# Altium schematic sheet task5.SchDoc
size A
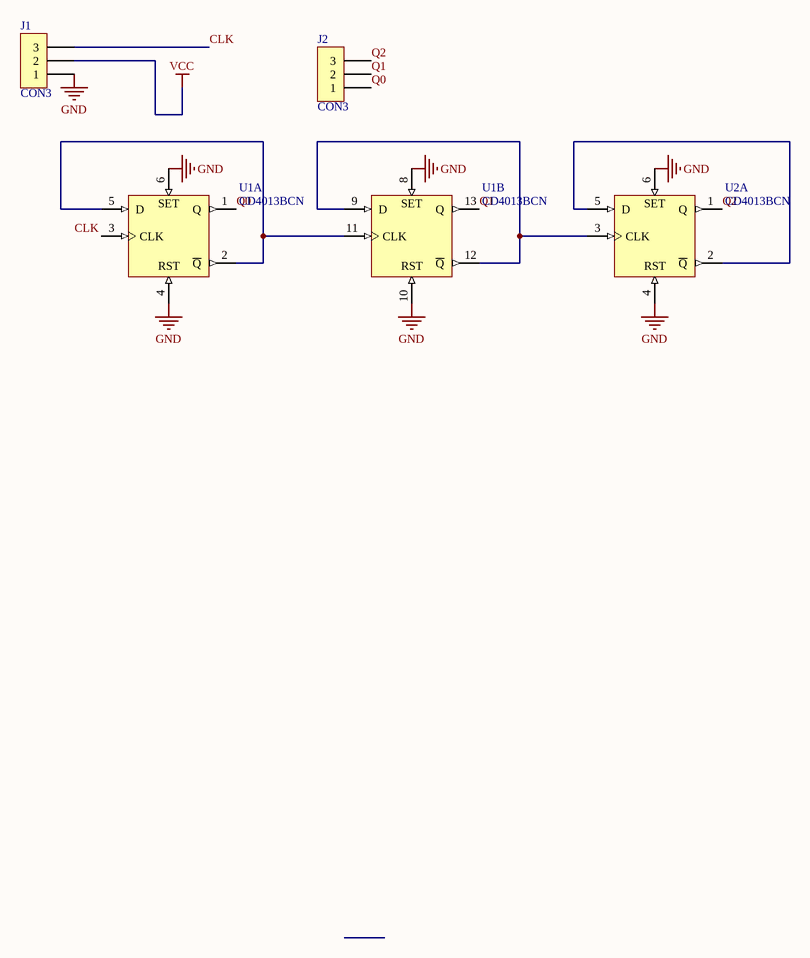
[diagram p0: task5.SchDoc]

## Parts
J1  CON3  [SIP3]
J2  CON3  [SIP3]
U1  CD4013BCN  [N14A]  (parts A,B of 2)
U2  CD4013BCN  [N14A]  (part A of 2)

## Nets
GND: J1.1 U1.4(RST) U1.6(S) U1.7(GND) U1.8(S) U1.10(RST) U2.4(RST) U2.6(S) U2.7(GND)
VCC: J1.2
VDD: U1.14(VDD) U2.14(VDD)
CLK: J1.3
Q0: J2.1 U1.1(Q)
Q1: J2.2 U1.13(Q)
Q2: J2.3 U2.1(Q)
NetU1_2: U1.2(~{Q}) U1.5(D) U1.11(CLK)
NetU1_9: U1.9(D) U1.12(~{Q}) U2.3(CLK)
NetU2_2: U2.2(~{Q}) U2.5(D)

Not connected (* = marked no-connect by the designer): U1 3(CLK)

## Notes on the sheet
- Labels drawn without touching a wire or pin: CLK
- (in symbol CD4013BCN, part A) SET
- (in symbol CD4013BCN, part B) SET

## Library data of the parts
U1 U2 = CD4013BCN: Dual D-Type Flip-Flop; Published: 17-Jul-2002; LatestRevisionDate: 29-May-2009; LatestRevisionNote: Component Body Added.; DatasheetVersion: Jan-1999; PackageVersion: 2000; PackageReference: N14A; Publisher: Altium Limited; PackageDescription: DIP, 14-Pin, Row Spacing 7.62 mm, Pitch 2.54 mm; ComponentLink1Description: Manufacturer Link; ComponentLink1URL: http://www.fairchildsemi.com/